# Altium schematic sheet USB_HUB1 DN PORT 1_2.SchDoc: USB_HUB 3.0
size A2; DrawnBy: Luca Schenetti; Revision: A; SheetNumber: 6; SheetTotal: 10
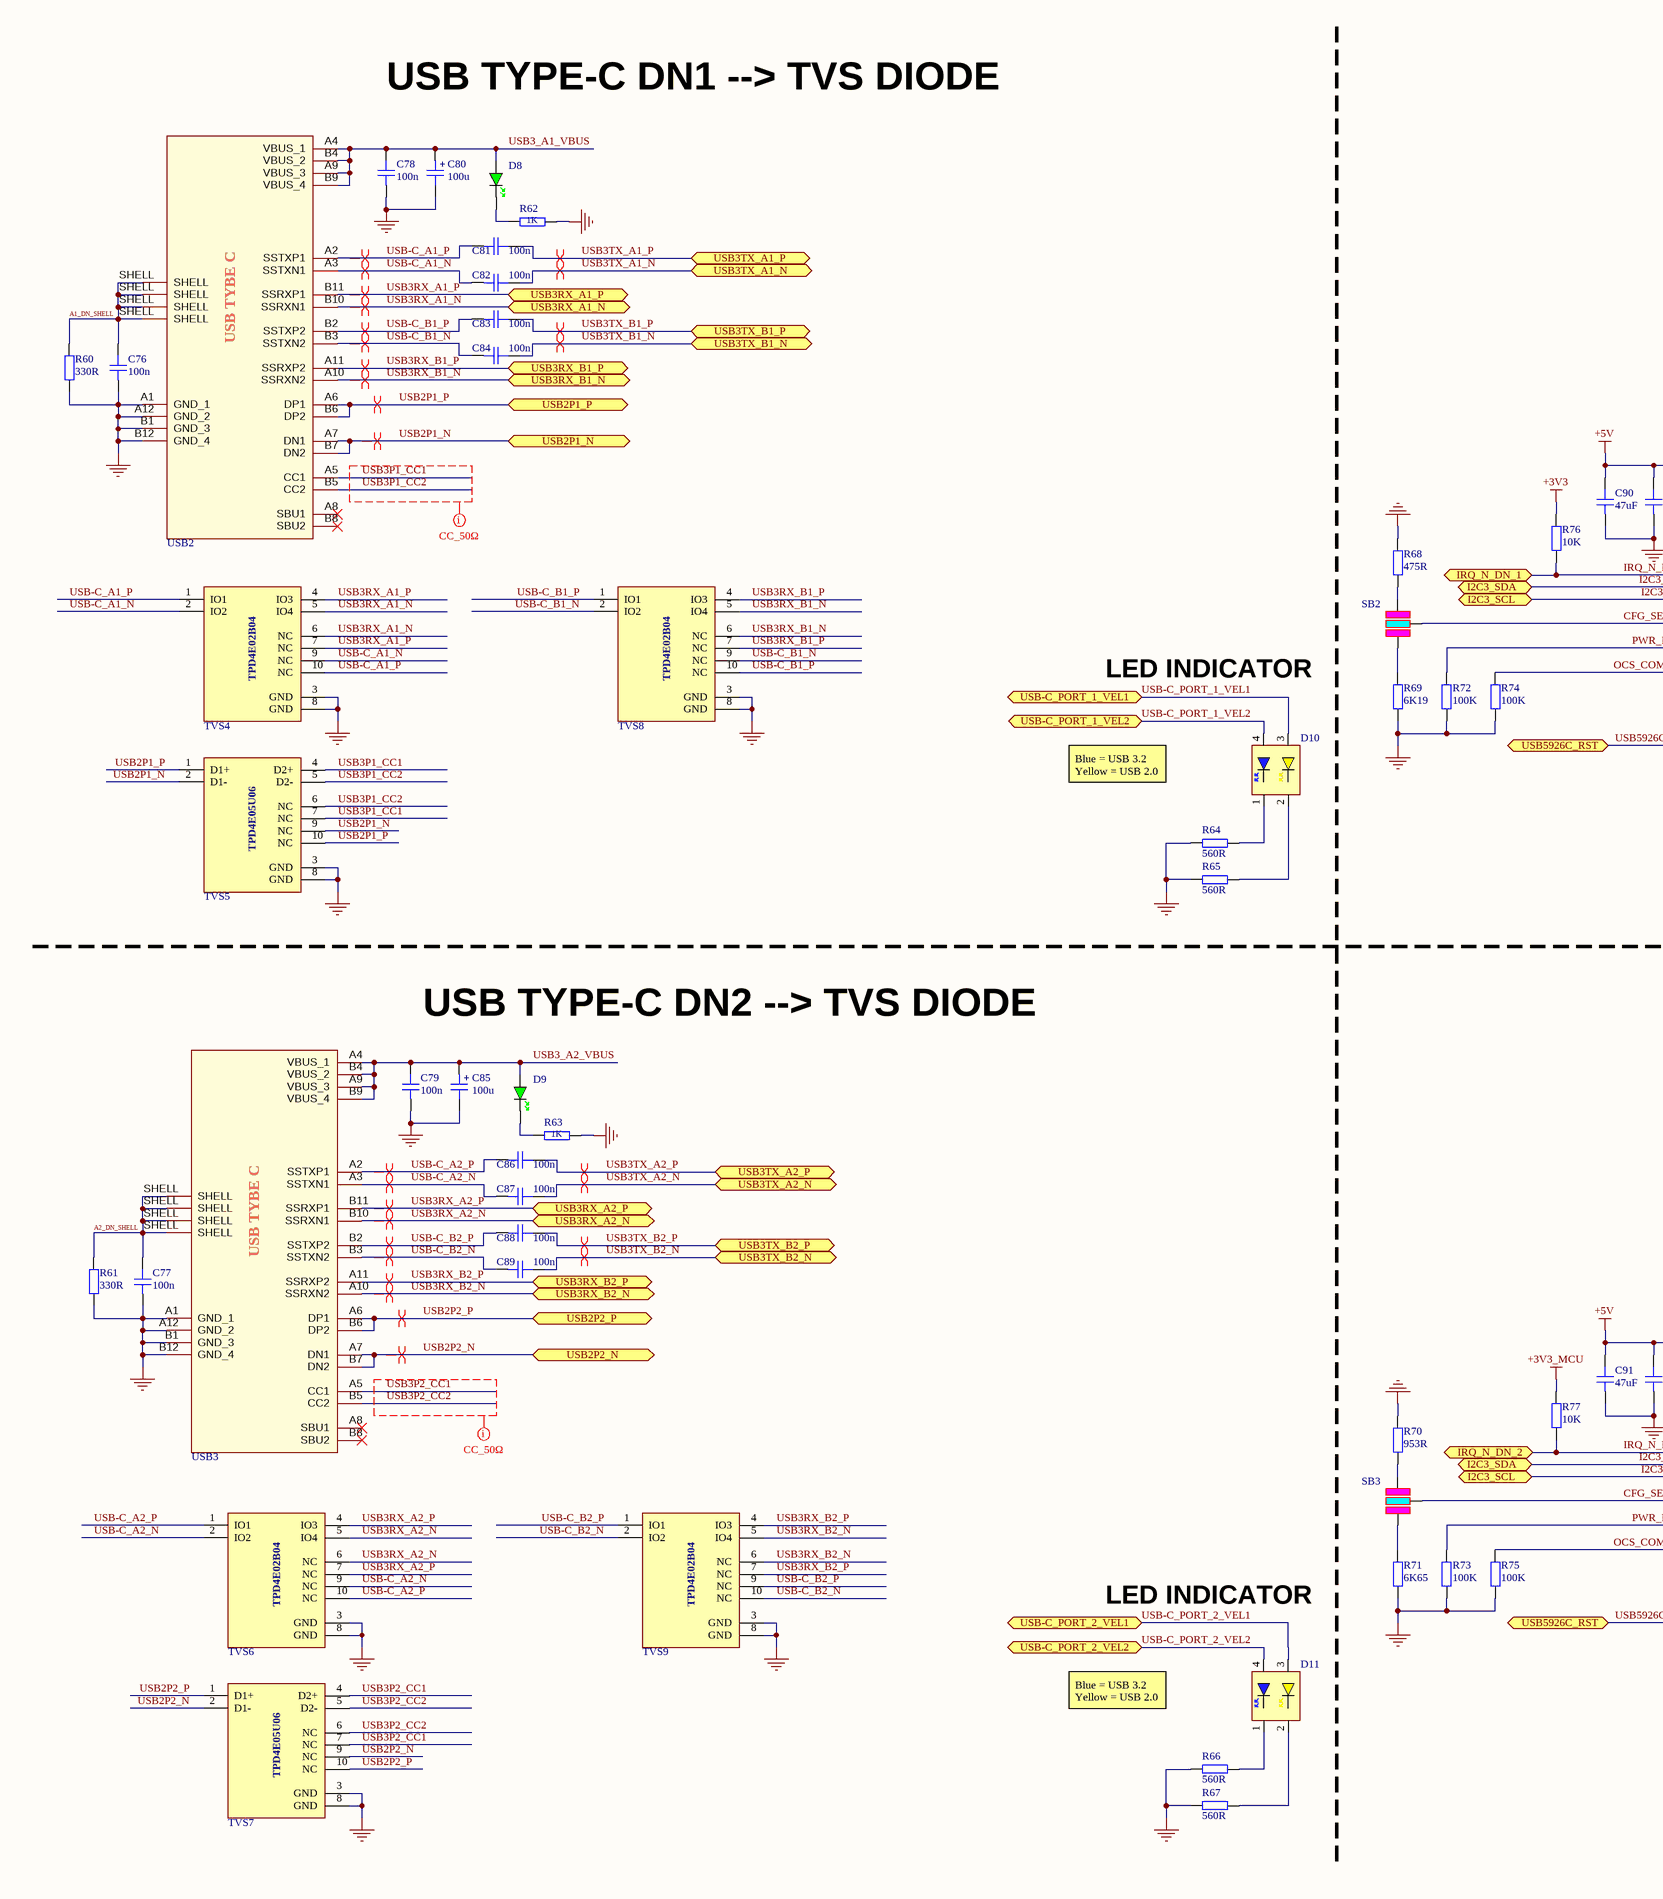
[diagram p0: USB_HUB1 DN PORT 1_2.SchDoc, left]
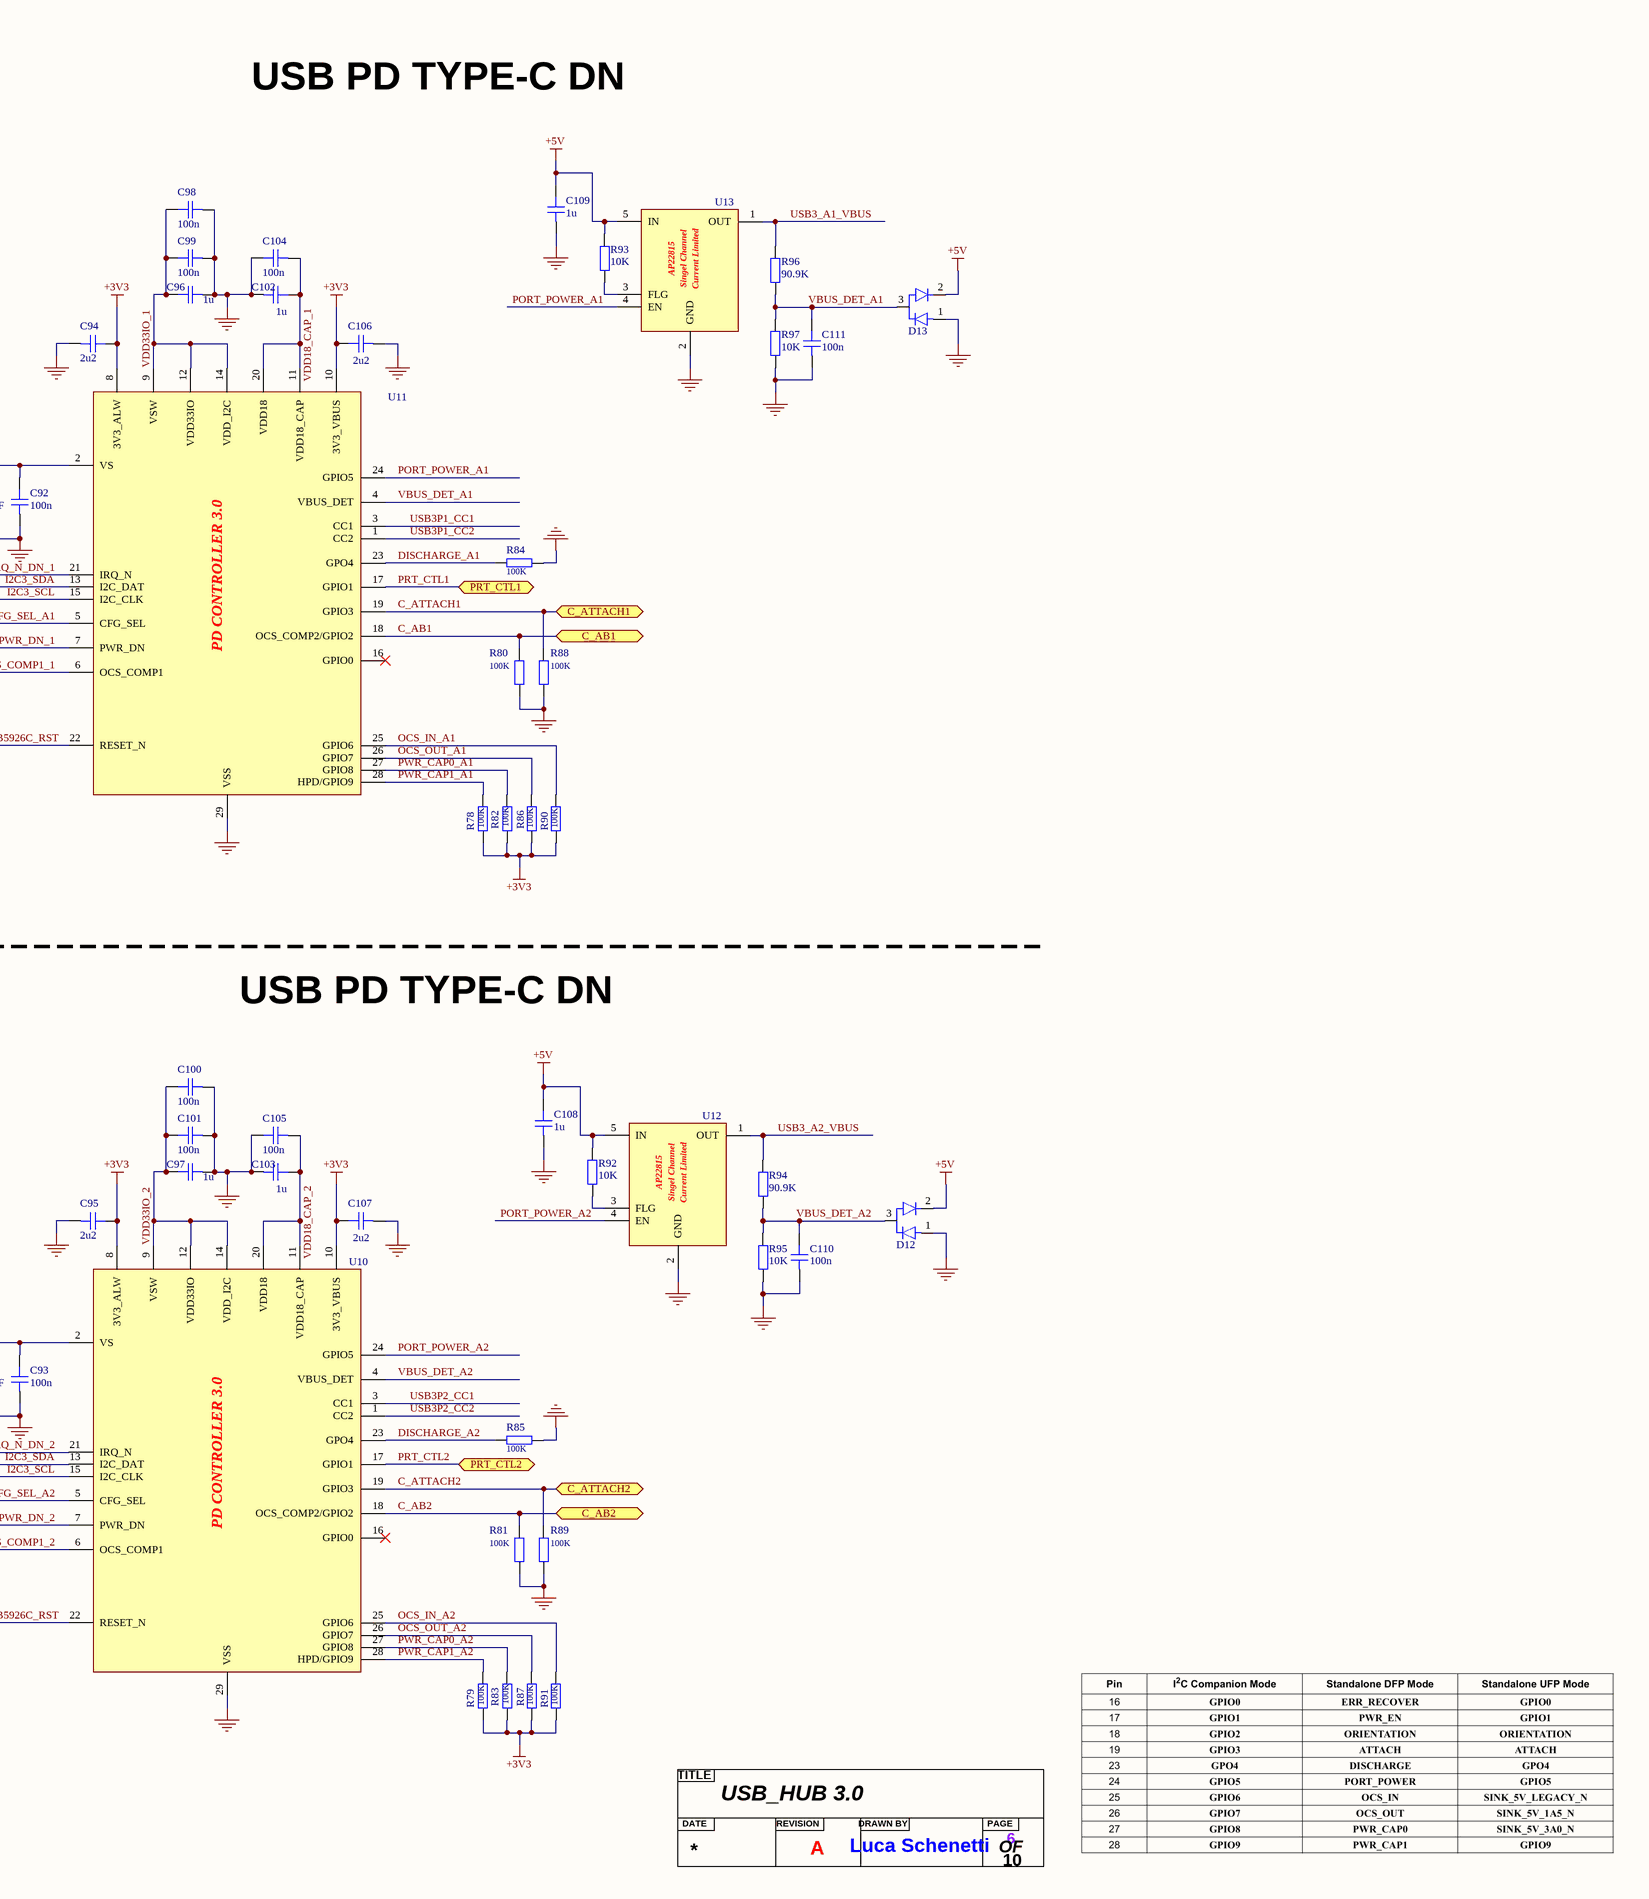
[diagram p1: USB_HUB1 DN PORT 1_2.SchDoc, right]

## Parts
?  Title  (value not drawn)  (graphical)
C76  100n  [CAP_0603]
C77  100n  [CAP_0603]
C78  100n  [CAP_0603]
C79  100n  [CAP_0603]
C80  100u  [CAP_AE_SMD_D6MM3_H5M55]
C81  100n  [CAP_0402]
C82  100n  [CAP_0402]
C83  100n  [CAP_0402]
C84  100n  [CAP_0402]
C85  100u  [CAP_AE_SMD_D6MM3_H5M55]
C86  100n  [CAP_0402]
C87  100n  [CAP_0402]
C88  100n  [CAP_0402]
C89  100n  [CAP_0402]
C90  47uF  [CAP_0603]
C91  47uF  [CAP_0603]
C92  100n  [CAP_0603]
C93  100n  [CAP_0603]
C94  2u2  [CAP_0603]
C95  2u2  [CAP_0603]
C96  1u  [CAP_0603]
C97  1u  [CAP_0603]
C98  100n  [CAP_0603]
C99  100n  [CAP_0603]
C100  100n  [CAP_0603]
C101  100n  [CAP_0603]
C102  1u  [CAP_0603]
C103  1u  [CAP_0603]
C104  100n  [CAP_0603]
C105  100n  [CAP_0603]
C106  2u2  [CAP_0603]
C107  2u2  [CAP_0603]
C108  1u  [CAP_0603]
C109  1u  [CAP_0603]
C110  100n  [CAP_0603]
C111  100n  [CAP_0603]
D8  GREEN  [LED_0603_GREEN]  (value not drawn)
D9  GREEN  [LED_0603_GREEN]  (value not drawn)
D10  TWO LED Yellow Blue 0603  [A-SP1962Y3B1C-C01-3T]  (value not drawn)
D11  TWO LED Yellow Blue 0603  [A-SP1962Y3B1C-C01-3T]  (value not drawn)
D12  High-Speed Switching Diode  [BAV99,215]  (value not drawn)
D13  High-Speed Switching Diode  [BAV99,215]  (value not drawn)
R60  330R  [RES_0603]
R61  330R  [RES_0603]
R62  1K  [RES_0603]
R63  1K  [RES_0603]
R64  560R  [RES_0603]
R65  560R  [RES_0603]
R66  560R  [RES_0603]
R67  560R  [RES_0603]
R68  475R  [RES_0603]
R69  6K19  [RES_0603]
R70  953R  [RES_0603]
R71  6K65  [RES_0603]
R72  100K  [RES_0603]
R73  100K  [RES_0603]
R74  100K  [RES_0603]
R75  100K  [RES_0603]
R76  10K  [RES_0603]
R77  10K  [RES_0603]
R78  100K  [RES_0603]
R79  100K  [RES_0603]
R80  100K  [RES_0603]
R81  100K  [RES_0603]
R82  100K  [RES_0603]
R83  100K  [RES_0603]
R84  100K  [RES_0603]
R85  100K  [RES_0603]
R86  100K  [RES_0603]
R87  100K  [RES_0603]
R88  100K  [RES_0603]
R89  100K  [RES_0603]
R90  100K  [RES_0603]
R91  100K  [RES_0603]
R92  10K  [RES_0603]
R93  10K  [RES_0603]
R94  90.9K  [RES_0603]
R95  10K  [RES_0603]
R96  90.9K  [RES_0603]
R97  10K  [RES_0603]
SB2  SOLDER BBRIDGE 3W  [SOLDER BRIDBE 3W]  (value not drawn)
SB3  SOLDER BBRIDGE 3W  [SOLDER BRIDBE 3W]  (value not drawn)
TVS4  TVS DIODE USB 3  [TPD4E02B04DQAR]  (value not drawn)
TVS5  ESD and Surge Protection USB, HDMI & High Speed  [TPD4E05U06DQAR]  (value not drawn)
TVS6  TVS DIODE USB 3  [TPD4E02B04DQAR]  (value not drawn)
TVS7  ESD and Surge Protection USB, HDMI & High Speed  [TPD4E05U06DQAR]  (value not drawn)
TVS8  TVS DIODE USB 3  [TPD4E02B04DQAR]  (value not drawn)
TVS9  TVS DIODE USB 3  [TPD4E02B04DQAR]  (value not drawn)
U10  USB Type-C® PD 3.0 Port Controller  [UPD350AT/Q8X]  (value not drawn)
U11  USB Type-C® PD 3.0 Port Controller  [UPD350AT/Q8X]  (value not drawn)
U12  Single-Channel, Current-Limited  [AP22815]  (value not drawn)
U13  Single-Channel, Current-Limited  [AP22815]  (value not drawn)
USB2  TYPE-C 24P QCHT  [TYPE-C 24P QCHT]  (value not drawn)
USB3  TYPE-C 24P QCHT  [TYPE-C 24P QCHT]  (value not drawn)

## Ports
C_AB1 (bidir, see USB_HUB1[3C]), C_AB2 (bidir, see USB_HUB1[3C]), C_ATTACH1 (bidir, see USB_HUB1[3C]), C_ATTACH2 (bidir, see USB_HUB1[3C]), I2C3_SCL (bidir, see MCU[2C], PWR[4B], PWR[11A], USB_HUB1 DN PORT 1_2[5B], USB_HUB1 UP PORT0[5B]), I2C3_SCL (bidir, see MCU[2C], PWR[4B], PWR[11A], USB_HUB1 DN PORT 1_2[5D], USB_HUB1 UP PORT0[5B]), I2C3_SDA (bidir, see MCU[4C], PWR[4B], PWR[11A], USB_HUB1 DN PORT 1_2[5B], USB_HUB1 UP PORT0[5B]), I2C3_SDA (bidir, see MCU[4C], PWR[4B], PWR[11A], USB_HUB1 DN PORT 1_2[5D], USB_HUB1 UP PORT0[5B]), IRQ_N_DN_1 (bidir, see MCU[2C]), IRQ_N_DN_2 (bidir, see MCU[2C]), PRT_CTL1 (bidir, see USB_HUB1[6D]), PRT_CTL2 (bidir, see USB_HUB1[6D]), USB2P1_N (bidir, see USB_HUB1[6B]), USB2P1_P (bidir, see USB_HUB1[6B]), USB2P2_N (bidir, see USB_HUB1[6C]), USB2P2_P (bidir, see USB_HUB1[6C]), USB3RX_A1_N (bidir, see USB_HUB1[6B]), USB3RX_A1_P (bidir, see USB_HUB1[6B]), USB3RX_A2_N (bidir, see USB_HUB1[6C]), USB3RX_A2_P (bidir, see USB_HUB1[6C]), USB3RX_B1_N (bidir, see USB_HUB1[6C]), USB3RX_B1_P (bidir, see USB_HUB1[6C]), USB3RX_B2_N (bidir, see USB_HUB1[6C]), USB3RX_B2_P (bidir, see USB_HUB1[6C]), USB3TX_A1_N (bidir, see USB_HUB1[6B]), USB3TX_A1_P (bidir, see USB_HUB1[6B]), USB3TX_A2_N (bidir, see USB_HUB1[6C]), USB3TX_A2_P (bidir, see USB_HUB1[6C]), USB3TX_B1_N (bidir, see USB_HUB1[6C]), USB3TX_B1_P (bidir, see USB_HUB1[6C]), USB3TX_B2_N (bidir, see USB_HUB1[6C]), USB3TX_B2_P (bidir, see USB_HUB1[6C]), USB5926C_RST (bidir, see MCU[8C], USB_HUB1 DN PORT 1_2[5B], USB_HUB1 DN PORT 5[3D], USB_HUB1 DN PORT 6[1C], USB_HUB1 UP PORT0[5C], USB_HUB1[3C]), USB5926C_RST (bidir, see MCU[8C], USB_HUB1 DN PORT 1_2[5D], USB_HUB1 DN PORT 5[3D], USB_HUB1 DN PORT 6[1C], USB_HUB1 UP PORT0[5C], USB_HUB1[3C]), USB-C_PORT_1_VEL1 (bidir, see MCU[2C]), USB-C_PORT_1_VEL2 (bidir, see MCU[2C]), USB-C_PORT_2_VEL1 (bidir, see MCU[4D]), USB-C_PORT_2_VEL2 (bidir, see MCU[4D])

## Nets
+3V3: C94.2 C95.2 C106.2 C107.2 R76.2 R78.1 R79.1 R82.1 R83.1 R86.1 R87.1 R90.1 R91.1 U10.8(3V3_ALW) U10.10(3V3_VBUS) U11.8(3V3_ALW) U11.10(3V3_VBUS)
+3V3_MCU: R77.2
+5V: C90.2 C91.2 C92.2 C93.2 C108.2 C109.2 D12.2 D13.2 R92.2 R93.2 U10.2(VS) U11.2(VS) U12.5(IN) U13.5(IN)
GND: C76.1 C77.1 C78.1 C79.1 C80.2 C85.2 C90.1 C91.1 C92.1 C93.1 C94.1 C95.1 C96.1 C97.1 C98.1 C99.1 C100.1 C101.1 C102.1 C103.1 C104.2 C105.2 C106.1 C107.1 C108.1 C109.1 C110.1 C111.1 D12.1 D13.1 R60.1 R61.1 R62.2 R63.2 R64.2 R65.2 R66.2 R67.2 R68.2 R69.1 R70.2 R71.1 R72.1 R73.1 R74.1 R75.1 R80.1 R81.1 R84.1 R85.1 R88.1 R89.1 R95.1 R97.1 TVS4.3(GND) TVS4.8(GND) TVS5.3(GND) TVS5.8(GND) TVS6.3(GND) TVS6.8(GND) TVS7.3(GND) TVS7.8(GND) TVS8.3(GND) TVS8.8(GND) TVS9.3(GND) TVS9.8(GND) U10.29(VSS) U11.29(VSS) U12.2(GND) U13.2(GND) USB2.A1(GND_1) USB2.A12(GND_2) USB2.B1(GND_3) USB2.B12(GND_4) USB3.A1(GND_1) USB3.A12(GND_2) USB3.B1(GND_3) USB3.B12(GND_4)
A1_DN_SHELL: C76.2 R60.2 USB2.SHELL
A2_DN_SHELL: C77.2 R61.2 USB3.SHELL
C_AB1: R80.2 U11.18(OCS_COMP2/GPIO2) ; port C_AB1
C_AB2: R81.2 U10.18(OCS_COMP2/GPIO2) ; port C_AB2
C_ATTACH1: R88.2 U11.19(GPIO3) ; port C_ATTACH1
C_ATTACH2: R89.2 U10.19(GPIO3) ; port C_ATTACH2
CFG_SEL_A1: SB2.1 U11.5(CFG_SEL)
CFG_SEL_A2: SB3.1 U10.5(CFG_SEL)
DISCHARGE_A1: R84.2 U11.23(GPO4)
DISCHARGE_A2: R85.2 U10.23(GPO4)
I2C3_SCL: U10.15(I2C_CLK) U11.15(I2C_CLK) ; port I2C3_SCL
I2C3_SDA: U10.13(I2C_DAT) U11.13(I2C_DAT) ; port I2C3_SDA
IRQ_N_DN_1: R76.1 U11.21(IRQ_N) ; port IRQ_N_DN_1
IRQ_N_DN_2: R77.1 U10.21(IRQ_N) ; port IRQ_N_DN_2
OCS_COMP1_1: R74.2 U11.6(OCS_COMP1)
OCS_COMP1_2: R75.2 U10.6(OCS_COMP1)
OCS_IN_A1: R90.2 U11.25(GPIO6)
OCS_IN_A2: R91.2 U10.25(GPIO6)
OCS_OUT_A1: R86.2 U11.26(GPIO7)
OCS_OUT_A2: R87.2 U10.26(GPIO7)
PORT_POWER_A1: U11.24(GPIO5) U13.4(EN)
PORT_POWER_A2: U10.24(GPIO5) U12.4(EN)
PRT_CTL1: U11.17(GPIO1) ; port PRT_CTL1
PRT_CTL2: U10.17(GPIO1) ; port PRT_CTL2
PWR_CAP0_A1: R82.2 U11.27(GPIO8)
PWR_CAP0_A2: R83.2 U10.27(GPIO8)
PWR_CAP1_A1: R78.2 U11.28(HPD/GPIO9)
PWR_CAP1_A2: R79.2 U10.28(HPD/GPIO9)
PWR_DN_1: R72.2 U11.7(PWR_DN)
PWR_DN_2: R73.2 U10.7(PWR_DN)
USB2P1_N: TVS5.2(D1-) TVS5.9(NC) USB2.A7(DN1) USB2.B7(DN2) ; port USB2P1_N
USB2P1_P: TVS5.1(D1+) TVS5.10(NC) USB2.A6(DP1) USB2.B6(DP2) ; port USB2P1_P
USB2P2_N: TVS7.2(D1-) TVS7.9(NC) USB3.A7(DN1) USB3.B7(DN2) ; port USB2P2_N
USB2P2_P: TVS7.1(D1+) TVS7.10(NC) USB3.A6(DP1) USB3.B6(DP2) ; port USB2P2_P
USB3_A1_VBUS: C78.2 C80.1 D8.A R96.2 U13.1(OUT) USB2.A4(VBUS_1) USB2.A9(VBUS_3) USB2.B4(VBUS_2) USB2.B9(VBUS_4)
USB3_A2_VBUS: C79.2 C85.1 D9.A R94.2 U12.1(OUT) USB3.A4(VBUS_1) USB3.A9(VBUS_3) USB3.B4(VBUS_2) USB3.B9(VBUS_4)
USB3P1_CC1: TVS5.4(D2+) TVS5.7(NC) U11.3(CC1) USB2.A5(CC1)
USB3P1_CC2: TVS5.5(D2-) TVS5.6(NC) U11.1(CC2) USB2.B5(CC2)
USB3P2_CC1: TVS7.4(D2+) TVS7.7(NC) U10.3(CC1) USB3.A5(CC1)
USB3P2_CC2: TVS7.5(D2-) TVS7.6(NC) U10.1(CC2) USB3.B5(CC2)
USB3RX_A1_N: TVS4.5(IO4) TVS4.6(NC) USB2.B10(SSRXN1) ; port USB3RX_A1_N
USB3RX_A1_P: TVS4.4(IO3) TVS4.7(NC) USB2.B11(SSRXP1) ; port USB3RX_A1_P
USB3RX_A2_N: TVS6.5(IO4) TVS6.6(NC) USB3.B10(SSRXN1) ; port USB3RX_A2_N
USB3RX_A2_P: TVS6.4(IO3) TVS6.7(NC) USB3.B11(SSRXP1) ; port USB3RX_A2_P
USB3RX_B1_N: TVS8.5(IO4) TVS8.6(NC) USB2.A10(SSRXN2) ; port USB3RX_B1_N
USB3RX_B1_P: TVS8.4(IO3) TVS8.7(NC) USB2.A11(SSRXP2) ; port USB3RX_B1_P
USB3RX_B2_N: TVS9.5(IO4) TVS9.6(NC) USB3.A10(SSRXN2) ; port USB3RX_B2_N
USB3RX_B2_P: TVS9.4(IO3) TVS9.7(NC) USB3.A11(SSRXP2) ; port USB3RX_B2_P
USB3TX_A1_N: C82.2 ; port USB3TX_A1_N
USB3TX_A1_P: C81.2 ; port USB3TX_A1_P
USB3TX_A2_N: C87.2 ; port USB3TX_A2_N
USB3TX_A2_P: C86.2 ; port USB3TX_A2_P
USB3TX_B1_N: C84.2 ; port USB3TX_B1_N
USB3TX_B1_P: C83.2 ; port USB3TX_B1_P
USB3TX_B2_N: C89.2 ; port USB3TX_B2_N
USB3TX_B2_P: C88.2 ; port USB3TX_B2_P
USB5926C_RST: U10.22(RESET_N) U11.22(RESET_N) ; port USB5926C_RST
USB-C_A1_N: C82.1 TVS4.2(IO2) TVS4.9(NC) USB2.A3(SSTXN1)
USB-C_A1_P: C81.1 TVS4.1(IO1) TVS4.10(NC) USB2.A2(SSTXP1)
USB-C_A2_N: C87.1 TVS6.2(IO2) TVS6.9(NC) USB3.A3(SSTXN1)
USB-C_A2_P: C86.1 TVS6.1(IO1) TVS6.10(NC) USB3.A2(SSTXP1)
USB-C_B1_N: C84.1 TVS8.2(IO2) TVS8.9(NC) USB2.B3(SSTXN2)
USB-C_B1_P: C83.1 TVS8.1(IO1) TVS8.10(NC) USB2.B2(SSTXP2)
USB-C_B2_N: C89.1 TVS9.2(IO2) TVS9.10(NC) USB3.B3(SSTXN2)
USB-C_B2_P: C88.1 TVS9.1(IO1) TVS9.9(NC) USB3.B2(SSTXP2)
USB-C_PORT_1_VEL1: D10.3 ; port USB-C_PORT_1_VEL1
USB-C_PORT_1_VEL2: D10.4 ; port USB-C_PORT_1_VEL2
USB-C_PORT_2_VEL1: D11.3 ; port USB-C_PORT_2_VEL1
USB-C_PORT_2_VEL2: D11.4 ; port USB-C_PORT_2_VEL2
VBUS_DET_A1: C111.2 D13.3 R96.1 R97.2 U11.4(VBUS_DET)
VBUS_DET_A2: C110.2 D12.3 R94.1 R95.2 U10.4(VBUS_DET)
VDD18_CAP_1: C102.2 C104.1 U11.11(VDD18_CAP) U11.20(VDD18)
VDD18_CAP_2: C103.2 C105.1 U10.11(VDD18_CAP) U10.20(VDD18)
VDD33IO_1: C96.2 C98.2 C99.2 U11.9(VSW) U11.12(VDD33IO) U11.14(VDD_I2C)
VDD33IO_2: C97.2 C100.2 C101.2 U10.9(VSW) U10.12(VDD33IO) U10.14(VDD_I2C)
NetD8_K: D8.K R62.1
NetD9_K: D9.K R63.1
NetD10_1: D10.1 R64.1
NetD10_2: D10.2 R65.1
NetD11_1: D11.1 R66.1
NetD11_2: D11.2 R67.1
NetR68_1: R68.1 SB2.2
NetR69_2: R69.2 SB2.0
NetR70_1: R70.1 SB3.2
NetR71_2: R71.2 SB3.0
NetR92_1: R92.1 U12.3(FLG)
NetR93_1: R93.1 U13.3(FLG)

Not connected (* = marked no-connect by the designer): U10 16(GPIO0)*; U11 16(GPIO0)*; USB2 A8(SBU1)* B8(SBU2)*; USB3 A8(SBU1)* B8(SBU2)*

## Layout directives
differential pair; differential pair class DIFF_USB_90Ω: USB2P1_N, USB2P1_P, USB2P2_N, USB2P2_P, USB3RX_A1_N, USB3RX_A1_P, USB3RX_A2_N, USB3RX_A2_P, USB3RX_B1_N, USB3RX_B1_P, USB3RX_B2_N, USB3RX_B2_P, USB3TX_A1_N, USB3TX_A1_P, USB3TX_A2_N, USB3TX_A2_P, USB3TX_B1_N, USB3TX_B1_P, USB3TX_B2_N, USB3TX_B2_P, USB-C_A1_N, USB-C_A1_P, USB-C_A2_N, USB-C_A2_P, USB-C_B1_N, USB-C_B1_P, USB-C_B2_N, USB-C_B2_P
net class CC_50Ω: USB3P1_CC1, USB3P1_CC2, USB3P2_CC1, USB3P2_CC2

## Notes on the sheet
- USB TYPE-C DN1 --> TVS DIODE
- USB PD TYPE-C DN
- (near R68) Companion Mode
  I2C Slave Address = 1011_110
- LED INDICATOR
- I2C Slave Address = 1101_010
  DFP STANDALONE
- Blue = USB 3.2
  Yellow = USB 2.0
- USB TYPE-C DN2 --> TVS DIODE
- (near R70) Companion Mode
  I2C Slave Address = 1011_101
- I2C Slave Address = 1101_001
  DFP STANDALONE
- (in symbol AP22815AWT-7) AP22815; Singel Channel; Current Limited
- (in symbol CAP_ALEL_6.3x5.5) +
- (in symbol Title) TITLE; DATE; REVISION; DRAWN BY; PAGE; OF
- (in symbol TPD4E02B04DQAR) TPD4E02B04
- (in symbol TPD4E05U06DQAR) TPD4E05U06
- (in symbol TYPE-C 24P QCHT) USB TYBE C
- (in symbol UPD350AT/Q8X) PD CONTROLLER 3.0

## Library data of the parts
C76-C79 C92 C93 C98-C101 C104 C105 C110 C111 = CAP_0603: Capacitor SMD 0603 [C14663]; Manufacturer: *; Manufacturer Part Number: *; Distributor Link: *; LCSC: *; Rating: *; Dielectric: *
C80 C85 = CAP_ALEL_6.3x5.5: [C59936]; Manufacturer: *; Manufacturer Part Number: *; Distributor Link: *; LCSC: *
C81-C84 C86-C89 = CAP_0402: Capacitor SMD 0402[C1525]; Manufacturer: *; Manufacturer Part Number: *; Distributor Link: *; LCSC: *; Rating: *; Dielectric: *
C90 C91 = CAP_0603: Capacitor SMD 0603 [C730416]; Manufacturer: *; Manufacturer Part Number: *; Distributor Link: *; LCSC: *; Rating: *; Dielectric: *
C94 C95 C106 C107 = CAP_0603: Capacitor SMD 0603 [C23630]; Manufacturer: *; Manufacturer Part Number: *; Distributor Link: *; LCSC: *; Rating: *; Dielectric: *
C96 C97 C102 C103 C108 C109 = CAP_0603: Capacitor SMD 0603 [C15849]; Manufacturer: *; Manufacturer Part Number: *; Distributor Link: *; LCSC: *; Rating: *; Dielectric: *
D8 D9 = LED_0603_GREEN: [C2986059]
D10 D11 = A-SP1962Y3B1C-C01-3T: [C19171299]
D12 D13 = BAV99,215: [C2500]
R60 R61 = RES_0603: [C23138]; Manufacturer: *; Manufacturer Part Number: *; Distributor Link: *; LCSC: *
R62 R63 = RES_0603: [C21190]; Manufacturer: *; Manufacturer Part Number: *; Distributor Link: *; LCSC: *
R64-R67 = RES_0603: [C23204]; Manufacturer: *; Manufacturer Part Number: *; Distributor Link: *; LCSC: *
R68 = RES_0603: [C23181]; Manufacturer: *; Manufacturer Part Number: *; Distributor Link: *; LCSC: *
R69 = RES_0603: [C25978]; Manufacturer: *; Manufacturer Part Number: *; Distributor Link: *; LCSC: *
R70 = RES_0603: [C93622]; Manufacturer: *; Manufacturer Part Number: *; Distributor Link: *; LCSC: *
R71 = RES_0603: [C3016441]; Manufacturer: *; Manufacturer Part Number: *; Distributor Link: *; LCSC: *
R72-R75 R78-R91 = RES_0603: [C25803]; Manufacturer: *; Manufacturer Part Number: *; Distributor Link: *; LCSC: *
R76 R77 = RES_0603: Resistor SMD 0603[C25804]; Manufacturer: *; Manufacturer Part Number: *; Distributor Link: *; LCSC: *
R92 R93 R95 R97 = RES_0603: [C25804]; Manufacturer: *; Manufacturer Part Number: *; Distributor Link: *; LCSC: *
R94 R96 = RES_0603: [C23129]; Manufacturer: *; Manufacturer Part Number: *; Distributor Link: *; LCSC: *
TVS4 TVS6 TVS8 TVS9 = TPD4E02B04DQAR: [C106794]
TVS5 TVS7 = TPD4E05U06DQAR: [C138714]
U10 U11 = UPD350AT/Q8X: [C622602]
U12 U13 = AP22815AWT-7: [C2150007]
USB2 USB3 = TYPE-C 24P QCHT: [C456013]